# Altium project Sensor Bar 2.0 by GAO.PrjPcb
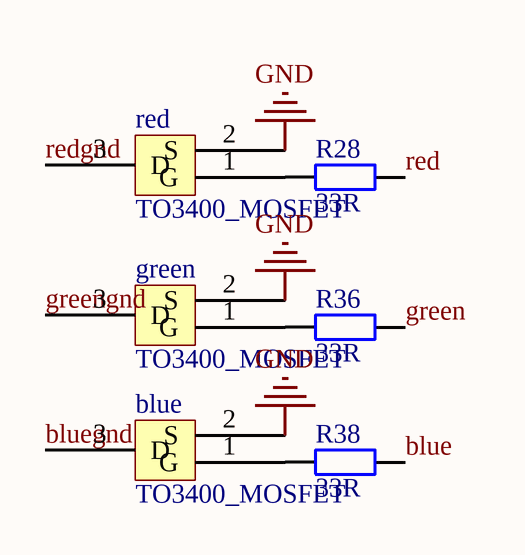
[diagram p0: Sensor Bar 2.0 RGB LED.SchDoc]
8 sheets, 247 parts. Net scope: global (net labels, ports and power ports of the same name join across sheets).
Board file: Sensor Bar 2.0 by GAO.PcbDoc
Sheets:
  Sensor Bar 2.0 RGB LED.SchDoc
  Sensor Bar 2.0 by GAO.SchDoc
  Sensor Bar 2.0 regulators.SchDoc
  Sensor Bar 2.0 sensors.SchDoc
  Sensor Bar 2.0 signal LED.SchDoc
  redx.SchDoc
  green.SchDoc
  blue.SchDoc

## Sheet Sensor Bar 2.0 RGB LED.SchDoc
size A4

### Parts
blue  TO3400_MOSFET  [npn]
green  TO3400_MOSFET  [npn]
R28  33R  [CR2012-0805]
R36  33R  [CR2012-0805]
R38  33R  [CR2012-0805]
red  TO3400_MOSFET  [npn]

### Nets
GND: blue.2(S) green.2(S) red.2(S)
blue: R38.1
bluegnd: blue.3(D)
green: R36.1
greengnd: green.3(D)
red: R28.1
redgnd: red.3(D)
Netblue_1: blue.1(G) R38.2
Netgreen_1: green.1(G) R36.2
NetR28_2: R28.2 red.1(G)

### Library data of the parts
R28 R36 R38 = Res2: Resistor; Published: 8-Jun-2000; Revision: July-2002: Re-released for DXP Platform.; Publisher: Altium Limited

## Sheet Sensor Bar 2.0 by GAO.SchDoc
size A4
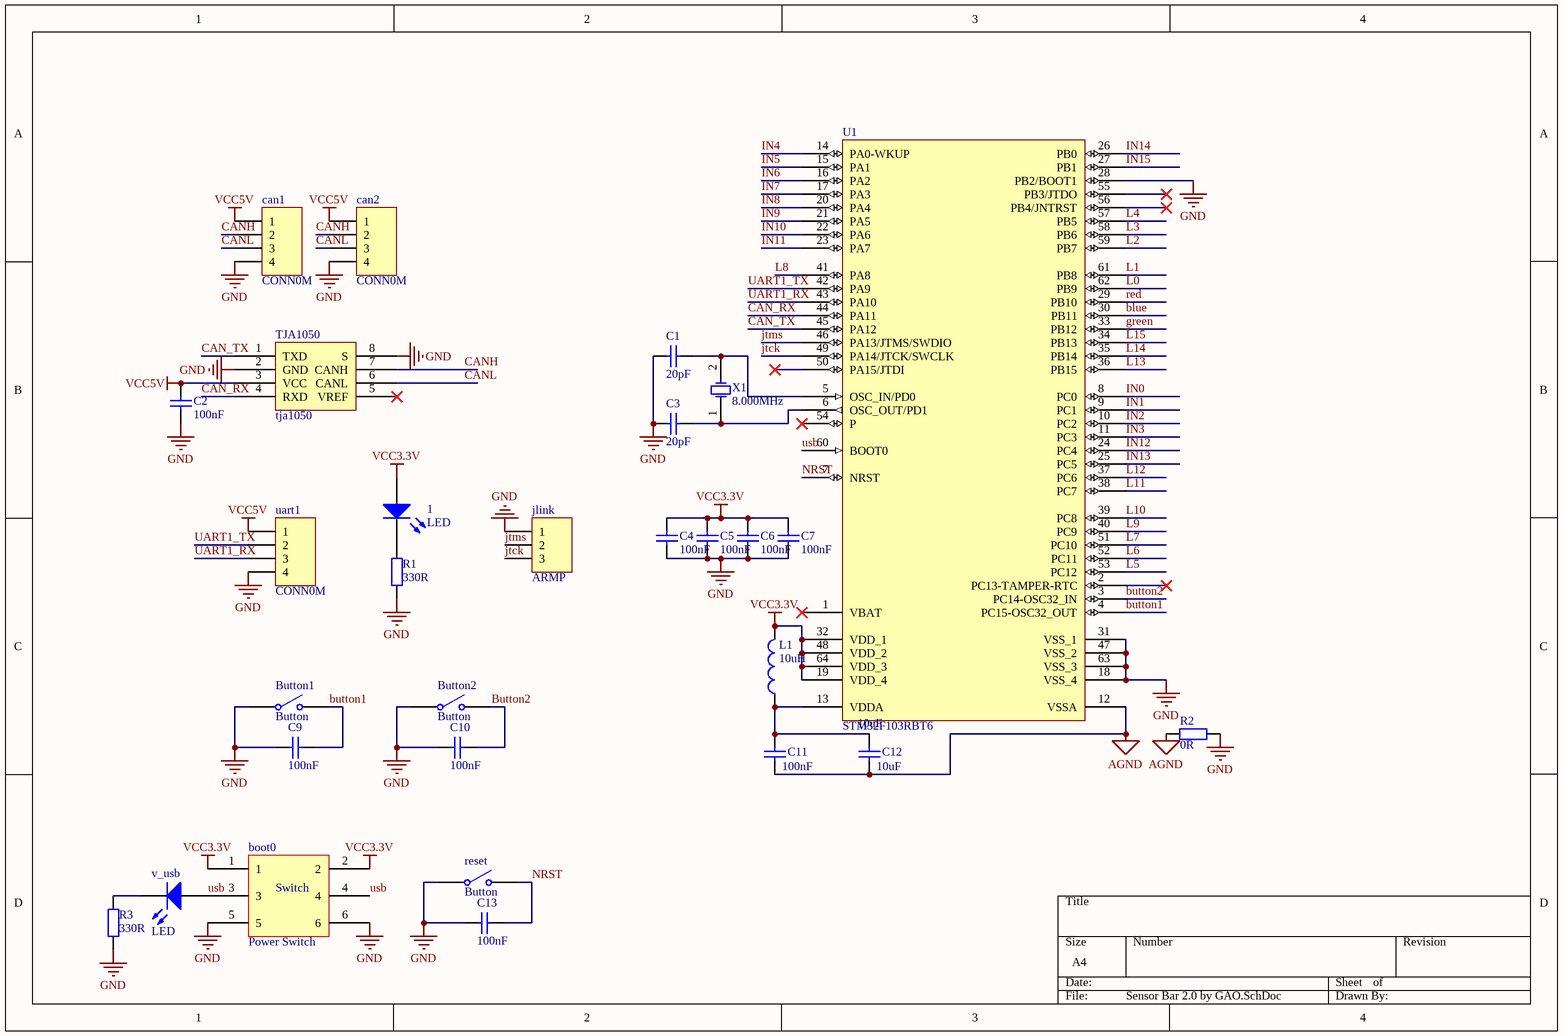
[diagram p1: Sensor Bar 2.0 by GAO.SchDoc]

### Parts
1  LED  [SMD _LED]
boot0  Power Switch  [POWER SWITCH]
Button1  Button  [PUSH SWITCH]
Button2  Button  [PUSH SWITCH]
C1  20pF  [CC2012-0805]
C2  100nF  [CC2012-0805]
C3  20pF  [CC2012-0805]
C4  100nF  [CC2012-0805]
C5  100nF  [CC2012-0805]
C6  100nF  [CC2012-0805]
C7  100nF  [CC2012-0805]
C9  100nF  [CC2012-0805]
C10  100nF  [CC2012-0805]
C11  100nF  [CC2012-0805]
C12  10uF  [CC3216-1206]
C13  100nF  [CC2012-0805]
can1  CONN0M  [LOCKEDHDR-4]
can2  CONN0M  [LOCKEDHDR-4]
jlink  ARMP  [LOCKEDHDR-3]
L1  10uH  [CR3225-1210]
R1  330R  [CR2012-0805]
R2  value 0R  [CR2012-0805]  (hidden comment: oR)
R3  330R  [CR2012-0805]
reset  Button  [PUSH SWITCH]
TJA1050  tja1050  [ad8210]
U1  STM32F103RBT6  [LQFP64_N]
uart1  CONN0M  [LOCKEDHDR-4]
v_usb  LED  [SMD _LED]
X1  8.000MHz  [BCY-W2/E4.7]

### Nets
AGND: C11.1 C12.1 R2.2 U1.12(VSSA)
GND: boot0.5 boot0.6 Button1.1(COMMON) Button2.1(COMMON) C1.2 C2.1 C3.2 C4.1 C5.1 C6.1 C7.1 C9.2 C10.2 C13.2 can1.4 can2.4 jlink.1 R1.1 R2.1 R3.1 reset.1(COMMON) TJA1050.2(GND) TJA1050.8(S) U1.18(VSS_4) U1.28(PB2/BOOT1) U1.31(VSS_1) U1.47(VSS_2) U1.63(VSS_3) uart1.4
VCC3.3V: 1.1(A) boot0.1 boot0.2 C4.2 C5.2 C6.2 C7.2 L1.2 U1.19(VDD_4) U1.32(VDD_1) U1.48(VDD_2) U1.64(VDD_3)
VCC5V: C2.2 can1.1 can2.1 TJA1050.3(VCC) uart1.1
blue: U1.30(PB11)
button1: Button1.2(NO) C9.1 U1.4(PC15-OSC32_OUT)
Button2: Button2.2(NO) C10.1 U1.3(PC14-OSC32_IN)
CAN_RX: TJA1050.4(RXD) U1.44(PA11)
CAN_TX: TJA1050.1(TXD) U1.45(PA12)
CANH: can1.2 can2.2 TJA1050.7(CANH)
CANL: can1.3 can2.3 TJA1050.6(CANL)
green: U1.33(PB12)
IN0: U1.8(PC0)
IN1: U1.9(PC1)
IN2: U1.10(PC2)
IN3: U1.11(PC3)
IN4: U1.14(PA0-WKUP)
IN5: U1.15(PA1)
IN6: U1.16(PA2)
IN7: U1.17(PA3)
IN8: U1.20(PA4)
IN9: U1.21(PA5)
IN10: U1.22(PA6)
IN11: U1.23(PA7)
IN12: U1.24(PC4)
IN13: U1.25(PC5)
IN14: U1.26(PB0)
IN15: U1.27(PB1)
jtck: jlink.3 U1.49(PA14/JTCK/SWCLK)
jtms: jlink.2 U1.46(PA13/JTMS/SWDIO)
L0: U1.62(PB9)
L1: U1.61(PB8)
L2: U1.59(PB7)
L3: U1.58(PB6)
L4: U1.57(PB5)
L5: U1.53(PC12)
L6: U1.52(PC11)
L7: U1.51(PC10)
L8: U1.41(PA8)
L9: U1.40(PC9)
L10: U1.39(PC8)
L11: U1.38(PC7)
L12: U1.37(PC6)
L13: U1.36(PB15)
L14: U1.35(PB14)
L15: U1.34(PB13)
NRST: C13.1 reset.2(NO) U1.7(NRST)
red: U1.29(PB10)
UART1_RX: U1.43(PA10) uart1.3
UART1_TX: U1.42(PA9) uart1.2
usb: boot0.3 boot0.4 U1.60(BOOT0) v_usb.1(A)
Net1_2: 1.2(K) R1.2
NetC1_1: C1.1 U1.5(OSC_IN/PD0) X1.2(OSC2)
NetC3_1: C3.1 U1.6(OSC_OUT/PD1) X1.1(OSC1)
NetC11_2: C11.2 C12.2 L1.1 U1.13(VDDA)
NetR3_2: R3.2 v_usb.2(K)

Not connected (* = marked no-connect by the designer): TJA1050 5(VREF)*; U1 1(VBAT)* 2(PC13-TAMPER-RTC)* 50(PA15/JTDI)* 54(P)* 55(PB3/JTDO)* 56(PB4/JNTRST)*

### Notes on the sheet
- (in symbol Power Switch) Switch

### Library data of the parts
1 v_usb = LED1: Typical RED GaAs LED; Published: 8-Jun-2000; LatestRevisionDate: 08-Jul-2005; LatestRevisionNote: Mech Layer 1 removed.; PackageReference: LED-1; Publisher: Altium Limited
Button1 Button2 reset = SW-SPST: Single-Pole, Single-Throw Switch; Published: 24-Mar-1999; Revision: July-2002: Re-released for DXP Platform.; Publisher: Altium Limited
C1-C7 C9-C13 = Cap Semi: Capacitor (Semiconductor SIM Model); Published: 8-Jun-2000; LatestRevisionDate: 17-Jul-2002; LatestRevisionNote: Re-released for DXP Platform.; PackageReference: C1206; Publisher: Altium Limited
  C11: value: 100nF
  C12: value: 10uF
can1 can2 uart1 = Header 4: Header, 4-Pin; Revision: 17-Jul-2002: Re-released for DXP Platform.; Publisher: Altium Limited
jlink = Header 3: Header, 3-Pin; Revision: 17-Jul-2002: Re-released for DXP Platform.; Publisher: Altium Limited
L1 = Inductor: Published: 8-Jun-2000; Revision: July-2002: Re-released for DXP Platform.; Publisher: Altium Limited; Value: 10uH
R1-R3 = Res2: Resistor; Published: 8-Jun-2000; Revision: July-2002: Re-released for DXP Platform.; Publisher: Altium Limited
  R3: Value: 330R
U1 = STM32F103RBT6: STM32 ARM-based 32-bit MCU with 128 Kbytes Flash, 64-pin LQFP, Industrial Temperature; Published: 30-May-2008; DatasheetVersion: rev6, Mar-2008; PackageVersion: Mar-2008; PackageReference: LQFP64; Publisher: Altium Limited; PackageDescription: 64-Pin Low-Profile Quad Flat Pack, 10 x 10 mm Body, 0.5 mm Pitch (LQFP64); ComponentLink1Description: Manufacturer Link; ComponentLink1URL: www.st.com/stm32; ComponentLink2Description: Datasheet; ComponentLink2URL: http://www.st.com/stonline/products/literature/ds/13587.pdf
X1 = XTAL: Crystal Oscillator; Published: 8-Jun-2000; Revision: July-2002: Re-released for DXP Platform.; Publisher: Altium Limited

## Sheet Sensor Bar 2.0 regulators.SchDoc
size A4
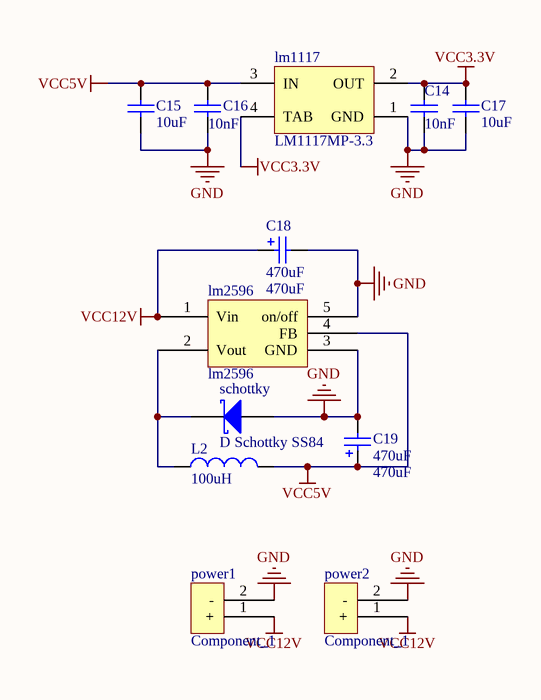
[diagram p2: Sensor Bar 2.0 regulators.SchDoc]

### Parts
C14  10nF  [CC2012-0805]
C15  10uF  [CC3225-1210]
C16  10nF  [CC2012-0805]
C17  10uF  [CC3225-1210]
C18  470uF  [470UF/50V]
C19  470uF  [470UF/50V]
L2  100uH  [MSS1260]
lm1117  LM1117MP-3.3  [MP04A_N]
lm2596  lm2596  [lm2596]
power1  Component_1  [PCBComponent_1]
power2  Component_1  [PCBComponent_1]
schottky  D Schottky SS84  [sch_diode]

### Nets
GND: C14.1 C15.2 C16.1 C17.2 C18.2 C19.2 lm1117.1(GND) lm2596.3(GND) lm2596.5(on/off) power1.2(-) power2.2(-) schottky.2(B)
VCC3.3V: C14.2 C17.1 lm1117.2(OUT) lm1117.4(TAB)
VCC5V: C15.1 C16.2 C19.1 L2.2 lm1117.3(IN) lm2596.4(FB)
VCC12V: C18.1 lm2596.1(Vin) power1.1(+) power2.1(+)
NetL2_1: L2.1 lm2596.2(Vout) schottky.1(A)

### Library data of the parts
C14-C17 = Cap Semi: Capacitor (Semiconductor SIM Model); Published: 8-Jun-2000; LatestRevisionDate: 17-Jul-2002; LatestRevisionNote: Re-released for DXP Platform.; PackageReference: C1206; Publisher: Altium Limited
C18 C19 = Cap Pol3: Polarized Capacitor (Surface Mount); Published: 8-Jun-2000; LatestRevisionDate: 29-May-2009; LatestRevisionNote: IPC-7351 Footprint Added.; PackageReference: C0805; Publisher: Altium Limited; PackageDescription: Chip Capacitor; Value: 470uF
L2 = Inductor: Published: 8-Jun-2000; Revision: July-2002: Re-released for DXP Platform.; Publisher: Altium Limited; Value: 100uH
lm1117 = LM1117MP-3.3: 800mA Low-Dropout Linear Regulator; Manufacturer: National Semiconductor; CompType: LDO IC; PackageTopMarking: XYTT*N05A; PowerWise: N; Published: 4-Dec-2008; DatasheetVersion: Apr-2006; PackageVersion: revB, Apr-2003; PackageReference: MP04A; Publisher: Altium Limited; PackageDescription: Molded SOT-223, 6.50 x 3.56 x 1.6mm Body, 4 Lead, 2.3mm Pitch; PartNumber: LM1117MP-3.3; RoHS: O; PinCount: 4; DigiKeyPartNumber: LM1117MP-3.3CT-ND; Code_JEDEC: TO-261-AA; Code_IPC: SOT223-4; ComponentLink1Description: LM1117 Datasheet; ComponentLink1URL: http://www.national.com/ds/LM/LM1117.pdf; ComponentLink2Description: LM1117 Web Page; ComponentLink2URL: http://www.national.com/pf/LM/LM1117.html; ComponentLink3Description: MP04A Package Page; ComponentLink3URL: http://www.national.com/packaging/folders/mp04a.html
lm2596 = Component_1
schottky = D Schottky: Schottky Diode; Code - JEDEC: DO-214-AA; Published: 8-Jun-2000; Revision: July-2002: Re-released for DXP Platform.; Publisher: Altium Limited

## Sheet Sensor Bar 2.0 sensors.SchDoc
size A4
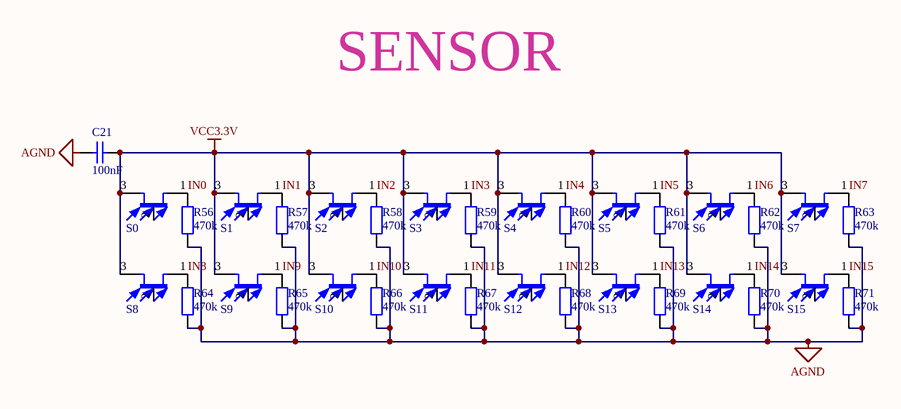
[diagram p3: Sensor Bar 2.0 sensors.SchDoc]

### Parts
C21  100nF  [CC2012-0805]
R56  470k  [CR2012-0805]
R57  470k  [CR2012-0805]
R58  470k  [CR2012-0805]
R59  470k  [CR2012-0805]
R60  470k  [CR2012-0805]
R61  470k  [CR2012-0805]
R62  470k  [CR2012-0805]
R63  470k  [CR2012-0805]
R64  470k  [CR2012-0805]
R65  470k  [CR2012-0805]
R66  470k  [CR2012-0805]
R67  470k  [CR2012-0805]
R68  470k  [CR2012-0805]
R69  470k  [CR2012-0805]
R70  470k  [CR2012-0805]
R71  470k  [CR2012-0805]
S0  3du5c  [CAN-3/D5.9]  (value not drawn)
S1  3du5c  [CAN-3/D5.9]  (value not drawn)
S2  3du5c  [CAN-3/D5.9]  (value not drawn)
S3  3du5c  [CAN-3/D5.9]  (value not drawn)
S4  3du5c  [CAN-3/D5.9]  (value not drawn)
S5  3du5c  [CAN-3/D5.9]  (value not drawn)
S6  3du5c  [CAN-3/D5.9]  (value not drawn)
S7  3du5c  [CAN-3/D5.9]  (value not drawn)
S8  3du5c  [CAN-3/D5.9]  (value not drawn)
S9  3du5c  [CAN-3/D5.9]  (value not drawn)
S10  3du5c  [CAN-3/D5.9]  (value not drawn)
S11  3du5c  [CAN-3/D5.9]  (value not drawn)
S12  3du5c  [CAN-3/D5.9]  (value not drawn)
S13  3du5c  [CAN-3/D5.9]  (value not drawn)
S14  3du5c  [CAN-3/D5.9]  (value not drawn)
S15  3du5c  [CAN-3/D5.9]  (value not drawn)

### Nets
AGND: C21.2 R56.1 R57.1 R58.1 R59.1 R60.1 R61.1 R62.1 R63.1 R64.1 R65.1 R66.1 R67.1 R68.1 R69.1 R70.1 R71.1
VCC3.3V: C21.1 S0.3 S1.3 S2.3 S3.3 S4.3 S5.3 S6.3 S7.3 S8.3 S9.3 S10.3 S11.3 S12.3 S13.3 S14.3 S15.3
IN0: R56.2 S0.1
IN1: R57.2 S1.1
IN2: R58.2 S2.1
IN3: R59.2 S3.1
IN4: R60.2 S4.1
IN5: R61.2 S5.1
IN6: R62.2 S6.1
IN7: R63.2 S7.1
IN8: R64.2 S8.1
IN9: R65.2 S9.1
IN10: R66.2 S10.1
IN11: R67.2 S11.1
IN12: R68.2 S12.1
IN13: R69.2 S13.1
IN14: R70.2 S14.1
IN15: R71.2 S15.1

Not connected (* = marked no-connect by the designer): S0 2; S1 2; S2 2; S3 2; S4 2; S5 2; S6 2; S7 2; S8 2; S9 2; S10 2; S11 2; S12 2; S13 2; S14 2; S15 2

### Notes on the sheet
- SENSOR

### Library data of the parts
C21 = Cap Semi: Capacitor (Semiconductor SIM Model); Published: 8-Jun-2000; LatestRevisionDate: 17-Jul-2002; LatestRevisionNote: Re-released for DXP Platform.; PackageReference: C1206; Publisher: Altium Limited
R56-R71 = Res2: Resistor; Published: 8-Jun-2000; Revision: July-2002: Re-released for DXP Platform.; Publisher: Altium Limited; Value: 470k
S0-S15 = Light

## Sheet Sensor Bar 2.0 signal LED.SchDoc
size A4
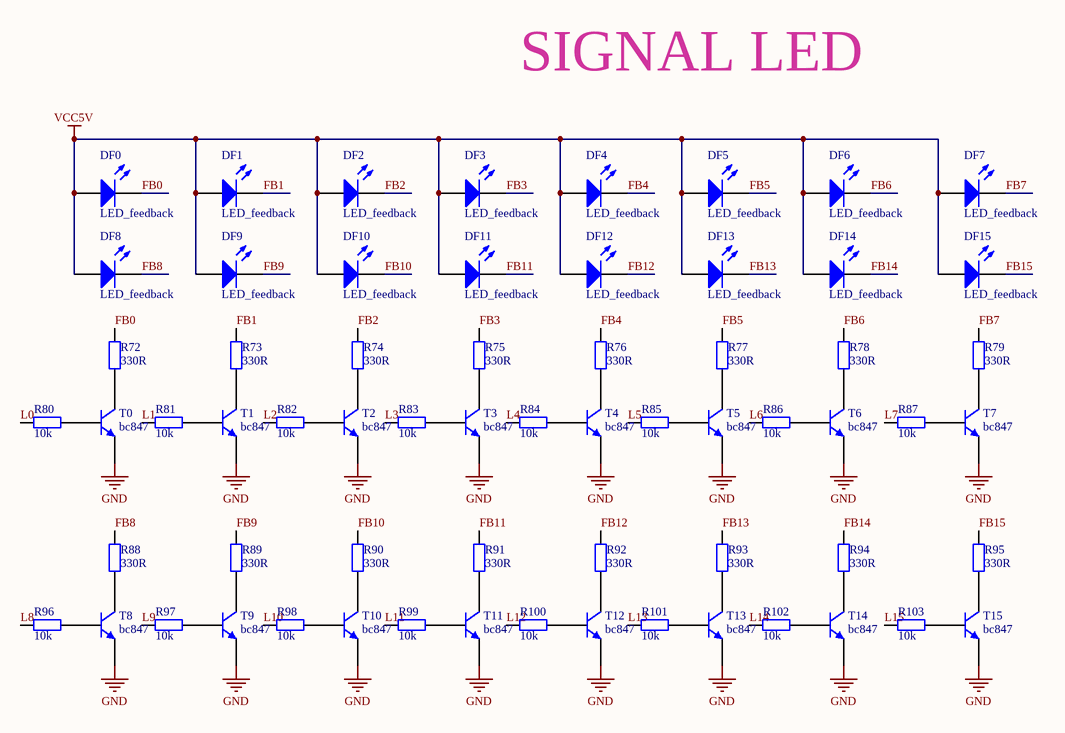
[diagram p4: Sensor Bar 2.0 signal LED.SchDoc]

### Parts
DF0  LED_feedback  [SMD _LED]
DF1  LED_feedback  [SMD _LED]
DF2  LED_feedback  [SMD _LED]
DF3  LED_feedback  [SMD _LED]
DF4  LED_feedback  [SMD _LED]
DF5  LED_feedback  [SMD _LED]
DF6  LED_feedback  [SMD _LED]
DF7  LED_feedback  [SMD _LED]
DF8  LED_feedback  [SMD _LED]
DF9  LED_feedback  [SMD _LED]
DF10  LED_feedback  [SMD _LED]
DF11  LED_feedback  [SMD _LED]
DF12  LED_feedback  [SMD _LED]
DF13  LED_feedback  [SMD _LED]
DF14  LED_feedback  [SMD _LED]
DF15  LED_feedback  [SMD _LED]
R72  330R  [CR2012-0805]
R73  330R  [CR2012-0805]
R74  330R  [CR2012-0805]
R75  330R  [CR2012-0805]
R76  330R  [CR2012-0805]
R77  330R  [CR2012-0805]
R78  330R  [CR2012-0805]
R79  330R  [CR2012-0805]
R80  10k  [CR2012-0805]
R81  10k  [CR2012-0805]
R82  10k  [CR2012-0805]
R83  10k  [CR2012-0805]
R84  10k  [CR2012-0805]
R85  10k  [CR2012-0805]
R86  10k  [CR2012-0805]
R87  10k  [CR2012-0805]
R88  330R  [CR2012-0805]
R89  330R  [CR2012-0805]
R90  330R  [CR2012-0805]
R91  330R  [CR2012-0805]
R92  330R  [CR2012-0805]
R93  330R  [CR2012-0805]
R94  330R  [CR2012-0805]
R95  330R  [CR2012-0805]
R96  10k  [CR2012-0805]
R97  10k  [CR2012-0805]
R98  10k  [CR2012-0805]
R99  10k  [CR2012-0805]
R100  10k  [CR2012-0805]
R101  10k  [CR2012-0805]
R102  10k  [CR2012-0805]
R103  10k  [CR2012-0805]
T0  bc847  [npn]
T1  bc847  [npn]
T2  bc847  [npn]
T3  bc847  [npn]
T4  bc847  [npn]
T5  bc847  [npn]
T6  bc847  [npn]
T7  bc847  [npn]
T8  bc847  [npn]
T9  bc847  [npn]
T10  bc847  [npn]
T11  bc847  [npn]
T12  bc847  [npn]
T13  bc847  [npn]
T14  bc847  [npn]
T15  bc847  [npn]

### Nets
GND: T0.2(E) T1.2(E) T2.2(E) T3.2(E) T4.2(E) T5.2(E) T6.2(E) T7.2(E) T8.2(E) T9.2(E) T10.2(E) T11.2(E) T12.2(E) T13.2(E) T14.2(E) T15.2(E)
VCC5V: DF0.1(A) DF1.1(A) DF2.1(A) DF3.1(A) DF4.1(A) DF5.1(A) DF6.1(A) DF7.1(A) DF8.1(A) DF9.1(A) DF10.1(A) DF11.1(A) DF12.1(A) DF13.1(A) DF14.1(A) DF15.1(A)
FB0: DF0.2(K) R72.2
FB1: DF1.2(K) R73.2
FB2: DF2.2(K) R74.2
FB3: DF3.2(K) R75.2
FB4: DF4.2(K) R76.2
FB5: DF5.2(K) R77.2
FB6: DF6.2(K) R78.2
FB7: DF7.2(K) R79.2
FB8: DF8.2(K) R88.2
FB9: DF9.2(K) R89.2
FB10: DF10.2(K) R90.2
FB11: DF11.2(K) R91.2
FB12: DF12.2(K) R92.2
FB13: DF13.2(K) R93.2
FB14: DF14.2(K) R94.2
FB15: DF15.2(K) R95.2
L0: R80.2
L1: R81.2
L2: R82.2
L3: R83.2
L4: R84.2
L5: R85.2
L6: R86.2
L7: R87.2
L8: R96.2
L9: R97.2
L10: R98.2
L11: R99.2
L12: R100.2
L13: R101.2
L14: R102.2
L15: R103.2
NetR72_1: R72.1 T0.3(C)
NetR73_1: R73.1 T1.3(C)
NetR74_1: R74.1 T2.3(C)
NetR75_1: R75.1 T3.3(C)
NetR76_1: R76.1 T4.3(C)
NetR77_1: R77.1 T5.3(C)
NetR78_1: R78.1 T6.3(C)
NetR79_1: R79.1 T7.3(C)
NetR80_1: R80.1 T0.1(B)
NetR81_1: R81.1 T1.1(B)
NetR82_1: R82.1 T2.1(B)
NetR83_1: R83.1 T3.1(B)
NetR84_1: R84.1 T4.1(B)
NetR85_1: R85.1 T5.1(B)
NetR86_1: R86.1 T6.1(B)
NetR87_1: R87.1 T7.1(B)
NetR88_1: R88.1 T8.3(C)
NetR89_1: R89.1 T9.3(C)
NetR90_1: R90.1 T10.3(C)
NetR91_1: R91.1 T11.3(C)
NetR92_1: R92.1 T12.3(C)
NetR93_1: R93.1 T13.3(C)
NetR94_1: R94.1 T14.3(C)
NetR95_1: R95.1 T15.3(C)
NetR96_1: R96.1 T8.1(B)
NetR97_1: R97.1 T9.1(B)
NetR98_1: R98.1 T10.1(B)
NetR99_1: R99.1 T11.1(B)
NetR100_1: R100.1 T12.1(B)
NetR101_1: R101.1 T13.1(B)
NetR102_1: R102.1 T14.1(B)
NetR103_1: R103.1 T15.1(B)

### Notes on the sheet
- SIGNAL LED

### Library data of the parts
DF0-DF15 = LED: Typical RED GaAs LED; Published: 8-Jun-2000; LatestRevisionDate: 08-Jul-2005; LatestRevisionNote: Mech Layer 1 removed.; PackageReference: LED-1; Publisher: Altium Limited
R72-R103 = Res2: Resistor; Published: 8-Jun-2000; Revision: July-2002: Re-released for DXP Platform.; Publisher: Altium Limited
  R72-R79 R88-R95: Value: 330R
  R80-R87 R96-R103: Value: 10k
T0-T15 = npn

## Sheet redx.SchDoc
size A4
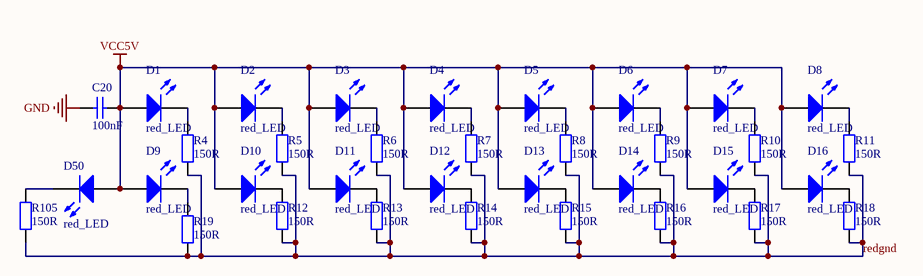
[diagram p5: redx.SchDoc]

### Parts
C20  100nF  [CC2012-0805]
D1  red_LED  [LED5MM]
D2  red_LED  [LED5MM]
D3  red_LED  [LED5MM]
D4  red_LED  [LED5MM]
D5  red_LED  [LED5MM]
D6  red_LED  [LED5MM]
D7  red_LED  [LED5MM]
D8  red_LED  [LED5MM]
D9  red_LED  [LED5MM]
D10  red_LED  [LED5MM]
D11  red_LED  [LED5MM]
D12  red_LED  [LED5MM]
D13  red_LED  [LED5MM]
D14  red_LED  [LED5MM]
D15  red_LED  [LED5MM]
D16  red_LED  [LED5MM]
D50  red_LED  [LED5MM]
R4  150R  [CR2012-0805]
R5  150R  [CR2012-0805]
R6  150R  [CR2012-0805]
R7  150R  [CR2012-0805]
R8  150R  [CR2012-0805]
R9  150R  [CR2012-0805]
R10  150R  [CR2012-0805]
R11  150R  [CR2012-0805]
R12  150R  [CR2012-0805]
R13  150R  [CR2012-0805]
R14  150R  [CR2012-0805]
R15  150R  [CR2012-0805]
R16  150R  [CR2012-0805]
R17  150R  [CR2012-0805]
R18  150R  [CR2012-0805]
R19  150R  [CR2012-0805]
R105  150R  [CR2012-0805]

### Nets
GND: C20.2
VCC5V: C20.1 D1.1(A) D2.1(A) D3.1(A) D4.1(A) D5.1(A) D6.1(A) D7.1(A) D8.1(A) D9.1(A) D10.1(A) D11.1(A) D12.1(A) D13.1(A) D14.1(A) D15.1(A) D16.1(A) D50.1(A)
redgnd: R4.1 R5.1 R6.1 R7.1 R8.1 R9.1 R10.1 R11.1 R12.1 R13.1 R14.1 R15.1 R16.1 R17.1 R18.1 R19.1 R105.1
NetD1_2: D1.2(K) R4.2
NetD2_2: D2.2(K) R5.2
NetD3_2: D3.2(K) R6.2
NetD4_2: D4.2(K) R7.2
NetD5_2: D5.2(K) R8.2
NetD6_2: D6.2(K) R9.2
NetD7_2: D7.2(K) R10.2
NetD8_2: D8.2(K) R11.2
NetD9_2: D9.2(K) R19.2
NetD10_2: D10.2(K) R12.2
NetD11_2: D11.2(K) R13.2
NetD12_2: D12.2(K) R14.2
NetD13_2: D13.2(K) R15.2
NetD14_2: D14.2(K) R16.2
NetD15_2: D15.2(K) R17.2
NetD16_2: D16.2(K) R18.2
NetD50_2: D50.2(K) R105.2

### Library data of the parts
C20 = Cap Semi: Capacitor (Semiconductor SIM Model); Published: 8-Jun-2000; LatestRevisionDate: 17-Jul-2002; LatestRevisionNote: Re-released for DXP Platform.; PackageReference: C1206; Publisher: Altium Limited
D1-D16 D50 = LED: Typical RED GaAs LED; Published: 8-Jun-2000; LatestRevisionDate: 08-Jul-2005; LatestRevisionNote: Mech Layer 1 removed.; PackageReference: LED-1; Publisher: Altium Limited
R4-R19 R105 = Res2: Resistor; Published: 8-Jun-2000; Revision: July-2002: Re-released for DXP Platform.; Publisher: Altium Limited; Value: 150R

## Sheet green.SchDoc
size A4
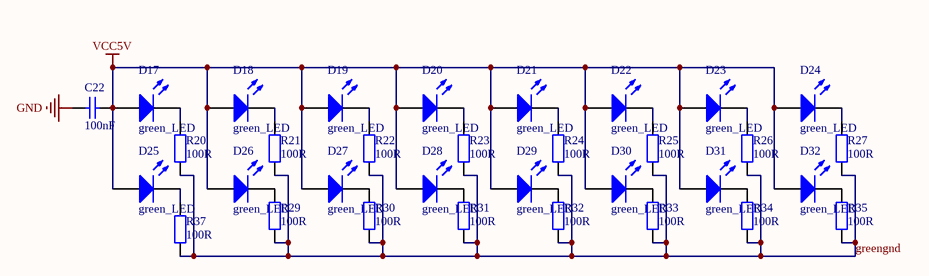
[diagram p6: green.SchDoc]

### Parts
C22  100nF  [CC2012-0805]
D17  green_LED  [LED5MM]
D18  green_LED  [LED5MM]
D19  green_LED  [LED5MM]
D20  green_LED  [LED5MM]
D21  green_LED  [LED5MM]
D22  green_LED  [LED5MM]
D23  green_LED  [LED5MM]
D24  green_LED  [LED5MM]
D25  green_LED  [LED5MM]
D26  green_LED  [LED5MM]
D27  green_LED  [LED5MM]
D28  green_LED  [LED5MM]
D29  green_LED  [LED5MM]
D30  green_LED  [LED5MM]
D31  green_LED  [LED5MM]
D32  green_LED  [LED5MM]
R20  100R  [CR2012-0805]
R21  100R  [CR2012-0805]
R22  100R  [CR2012-0805]
R23  100R  [CR2012-0805]
R24  100R  [CR2012-0805]
R25  100R  [CR2012-0805]
R26  100R  [CR2012-0805]
R27  100R  [CR2012-0805]
R29  100R  [CR2012-0805]
R30  100R  [CR2012-0805]
R31  100R  [CR2012-0805]
R32  100R  [CR2012-0805]
R33  100R  [CR2012-0805]
R34  100R  [CR2012-0805]
R35  100R  [CR2012-0805]
R37  100R  [CR2012-0805]

### Nets
GND: C22.2
VCC5V: C22.1 D17.1(A) D18.1(A) D19.1(A) D20.1(A) D21.1(A) D22.1(A) D23.1(A) D24.1(A) D25.1(A) D26.1(A) D27.1(A) D28.1(A) D29.1(A) D30.1(A) D31.1(A) D32.1(A)
greengnd: R20.1 R21.1 R22.1 R23.1 R24.1 R25.1 R26.1 R27.1 R29.1 R30.1 R31.1 R32.1 R33.1 R34.1 R35.1 R37.1
NetD17_2: D17.2(K) R20.2
NetD18_2: D18.2(K) R21.2
NetD19_2: D19.2(K) R22.2
NetD20_2: D20.2(K) R23.2
NetD21_2: D21.2(K) R24.2
NetD22_2: D22.2(K) R25.2
NetD23_2: D23.2(K) R26.2
NetD24_2: D24.2(K) R27.2
NetD25_2: D25.2(K) R37.2
NetD26_2: D26.2(K) R29.2
NetD27_2: D27.2(K) R30.2
NetD28_2: D28.2(K) R31.2
NetD29_2: D29.2(K) R32.2
NetD30_2: D30.2(K) R33.2
NetD31_2: D31.2(K) R34.2
NetD32_2: D32.2(K) R35.2

### Library data of the parts
C22 = Cap Semi: Capacitor (Semiconductor SIM Model); Published: 8-Jun-2000; LatestRevisionDate: 17-Jul-2002; LatestRevisionNote: Re-released for DXP Platform.; PackageReference: C1206; Publisher: Altium Limited
D17-D32 = LED: Typical RED GaAs LED; Published: 8-Jun-2000; LatestRevisionDate: 08-Jul-2005; LatestRevisionNote: Mech Layer 1 removed.; PackageReference: LED-1; Publisher: Altium Limited
R20-R27 R29-R35 R37 = Res2: Resistor; Published: 8-Jun-2000; Revision: July-2002: Re-released for DXP Platform.; Publisher: Altium Limited; Value: 100R

## Sheet blue.SchDoc
size A4
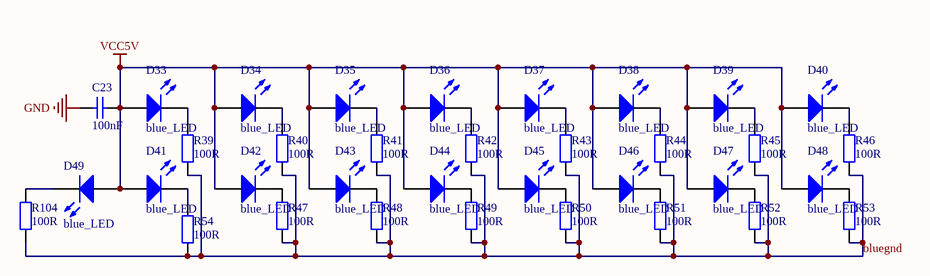
[diagram p7: blue.SchDoc]

### Parts
C23  100nF  [CC2012-0805]
D33  blue_LED  [LED5MM]
D34  blue_LED  [LED5MM]
D35  blue_LED  [LED5MM]
D36  blue_LED  [LED5MM]
D37  blue_LED  [LED5MM]
D38  blue_LED  [LED5MM]
D39  blue_LED  [LED5MM]
D40  blue_LED  [LED5MM]
D41  blue_LED  [LED5MM]
D42  blue_LED  [LED5MM]
D43  blue_LED  [LED5MM]
D44  blue_LED  [LED5MM]
D45  blue_LED  [LED5MM]
D46  blue_LED  [LED5MM]
D47  blue_LED  [LED5MM]
D48  blue_LED  [LED5MM]
D49  blue_LED  [LED5MM]
R39  100R  [CR2012-0805]
R40  100R  [CR2012-0805]
R41  100R  [CR2012-0805]
R42  100R  [CR2012-0805]
R43  100R  [CR2012-0805]
R44  100R  [CR2012-0805]
R45  100R  [CR2012-0805]
R46  100R  [CR2012-0805]
R47  100R  [CR2012-0805]
R48  100R  [CR2012-0805]
R49  100R  [CR2012-0805]
R50  100R  [CR2012-0805]
R51  100R  [CR2012-0805]
R52  100R  [CR2012-0805]
R53  100R  [CR2012-0805]
R54  100R  [CR2012-0805]
R104  100R  [CR2012-0805]

### Nets
GND: C23.2
VCC5V: C23.1 D33.1(A) D34.1(A) D35.1(A) D36.1(A) D37.1(A) D38.1(A) D39.1(A) D40.1(A) D41.1(A) D42.1(A) D43.1(A) D44.1(A) D45.1(A) D46.1(A) D47.1(A) D48.1(A) D49.1(A)
bluegnd: R39.1 R40.1 R41.1 R42.1 R43.1 R44.1 R45.1 R46.1 R47.1 R48.1 R49.1 R50.1 R51.1 R52.1 R53.1 R54.1 R104.1
NetD33_2: D33.2(K) R39.2
NetD34_2: D34.2(K) R40.2
NetD35_2: D35.2(K) R41.2
NetD36_2: D36.2(K) R42.2
NetD37_2: D37.2(K) R43.2
NetD38_2: D38.2(K) R44.2
NetD39_2: D39.2(K) R45.2
NetD40_2: D40.2(K) R46.2
NetD41_2: D41.2(K) R54.2
NetD42_2: D42.2(K) R47.2
NetD43_2: D43.2(K) R48.2
NetD44_2: D44.2(K) R49.2
NetD45_2: D45.2(K) R50.2
NetD46_2: D46.2(K) R51.2
NetD47_2: D47.2(K) R52.2
NetD48_2: D48.2(K) R53.2
NetD49_2: D49.2(K) R104.2

### Library data of the parts
C23 = Cap Semi: Capacitor (Semiconductor SIM Model); Published: 8-Jun-2000; LatestRevisionDate: 17-Jul-2002; LatestRevisionNote: Re-released for DXP Platform.; PackageReference: C1206; Publisher: Altium Limited
D33-D49 = LED: Typical RED GaAs LED; Published: 8-Jun-2000; LatestRevisionDate: 08-Jul-2005; LatestRevisionNote: Mech Layer 1 removed.; PackageReference: LED-1; Publisher: Altium Limited
R39-R54 R104 = Res2: Resistor; Published: 8-Jun-2000; Revision: July-2002: Re-released for DXP Platform.; Publisher: Altium Limited; Value: 100R

## Nets that join several sheets
AGND: Sensor Bar 2.0 by GAO (C11.1 C12.1 R2.2 U1.12), Sensor Bar 2.0 sensors (17 pins)
GND: Sensor Bar 2.0 RGB LED (blue.2 green.2 red.2), Sensor Bar 2.0 by GAO (29 pins), Sensor Bar 2.0 regulators (12 pins), Sensor Bar 2.0 signal LED (16 pins), redx (C20.2), green (C22.2), blue (C23.2)
VCC3.3V: Sensor Bar 2.0 by GAO (12 pins), Sensor Bar 2.0 regulators (C14.2 C17.1 lm1117.2 lm1117.4), Sensor Bar 2.0 sensors (17 pins)
VCC5V: Sensor Bar 2.0 by GAO (5 pins), Sensor Bar 2.0 regulators (6 pins), Sensor Bar 2.0 signal LED (16 pins), redx (18 pins), green (17 pins), blue (18 pins)
blue: Sensor Bar 2.0 RGB LED (R38.1), Sensor Bar 2.0 by GAO (U1.30)
bluegnd: Sensor Bar 2.0 RGB LED (blue.3), blue (17 pins)
green: Sensor Bar 2.0 RGB LED (R36.1), Sensor Bar 2.0 by GAO (U1.33)
greengnd: Sensor Bar 2.0 RGB LED (green.3), green (16 pins)
IN0: Sensor Bar 2.0 by GAO (U1.8), Sensor Bar 2.0 sensors (R56.2 S0.1)
IN1: Sensor Bar 2.0 by GAO (U1.9), Sensor Bar 2.0 sensors (R57.2 S1.1)
IN2: Sensor Bar 2.0 by GAO (U1.10), Sensor Bar 2.0 sensors (R58.2 S2.1)
IN3: Sensor Bar 2.0 by GAO (U1.11), Sensor Bar 2.0 sensors (R59.2 S3.1)
IN4: Sensor Bar 2.0 by GAO (U1.14), Sensor Bar 2.0 sensors (R60.2 S4.1)
IN5: Sensor Bar 2.0 by GAO (U1.15), Sensor Bar 2.0 sensors (R61.2 S5.1)
IN6: Sensor Bar 2.0 by GAO (U1.16), Sensor Bar 2.0 sensors (R62.2 S6.1)
IN7: Sensor Bar 2.0 by GAO (U1.17), Sensor Bar 2.0 sensors (R63.2 S7.1)
IN8: Sensor Bar 2.0 by GAO (U1.20), Sensor Bar 2.0 sensors (R64.2 S8.1)
IN9: Sensor Bar 2.0 by GAO (U1.21), Sensor Bar 2.0 sensors (R65.2 S9.1)
IN10: Sensor Bar 2.0 by GAO (U1.22), Sensor Bar 2.0 sensors (R66.2 S10.1)
IN11: Sensor Bar 2.0 by GAO (U1.23), Sensor Bar 2.0 sensors (R67.2 S11.1)
IN12: Sensor Bar 2.0 by GAO (U1.24), Sensor Bar 2.0 sensors (R68.2 S12.1)
IN13: Sensor Bar 2.0 by GAO (U1.25), Sensor Bar 2.0 sensors (R69.2 S13.1)
IN14: Sensor Bar 2.0 by GAO (U1.26), Sensor Bar 2.0 sensors (R70.2 S14.1)
IN15: Sensor Bar 2.0 by GAO (U1.27), Sensor Bar 2.0 sensors (R71.2 S15.1)
L0: Sensor Bar 2.0 by GAO (U1.62), Sensor Bar 2.0 signal LED (R80.2)
L1: Sensor Bar 2.0 by GAO (U1.61), Sensor Bar 2.0 signal LED (R81.2)
L2: Sensor Bar 2.0 by GAO (U1.59), Sensor Bar 2.0 signal LED (R82.2)
L3: Sensor Bar 2.0 by GAO (U1.58), Sensor Bar 2.0 signal LED (R83.2)
L4: Sensor Bar 2.0 by GAO (U1.57), Sensor Bar 2.0 signal LED (R84.2)
L5: Sensor Bar 2.0 by GAO (U1.53), Sensor Bar 2.0 signal LED (R85.2)
L6: Sensor Bar 2.0 by GAO (U1.52), Sensor Bar 2.0 signal LED (R86.2)
L7: Sensor Bar 2.0 by GAO (U1.51), Sensor Bar 2.0 signal LED (R87.2)
L8: Sensor Bar 2.0 by GAO (U1.41), Sensor Bar 2.0 signal LED (R96.2)
L9: Sensor Bar 2.0 by GAO (U1.40), Sensor Bar 2.0 signal LED (R97.2)
L10: Sensor Bar 2.0 by GAO (U1.39), Sensor Bar 2.0 signal LED (R98.2)
L11: Sensor Bar 2.0 by GAO (U1.38), Sensor Bar 2.0 signal LED (R99.2)
L12: Sensor Bar 2.0 by GAO (U1.37), Sensor Bar 2.0 signal LED (R100.2)
L13: Sensor Bar 2.0 by GAO (U1.36), Sensor Bar 2.0 signal LED (R101.2)
L14: Sensor Bar 2.0 by GAO (U1.35), Sensor Bar 2.0 signal LED (R102.2)
L15: Sensor Bar 2.0 by GAO (U1.34), Sensor Bar 2.0 signal LED (R103.2)
red: Sensor Bar 2.0 RGB LED (R28.1), Sensor Bar 2.0 by GAO (U1.29)
redgnd: Sensor Bar 2.0 RGB LED (red.3), redx (17 pins)